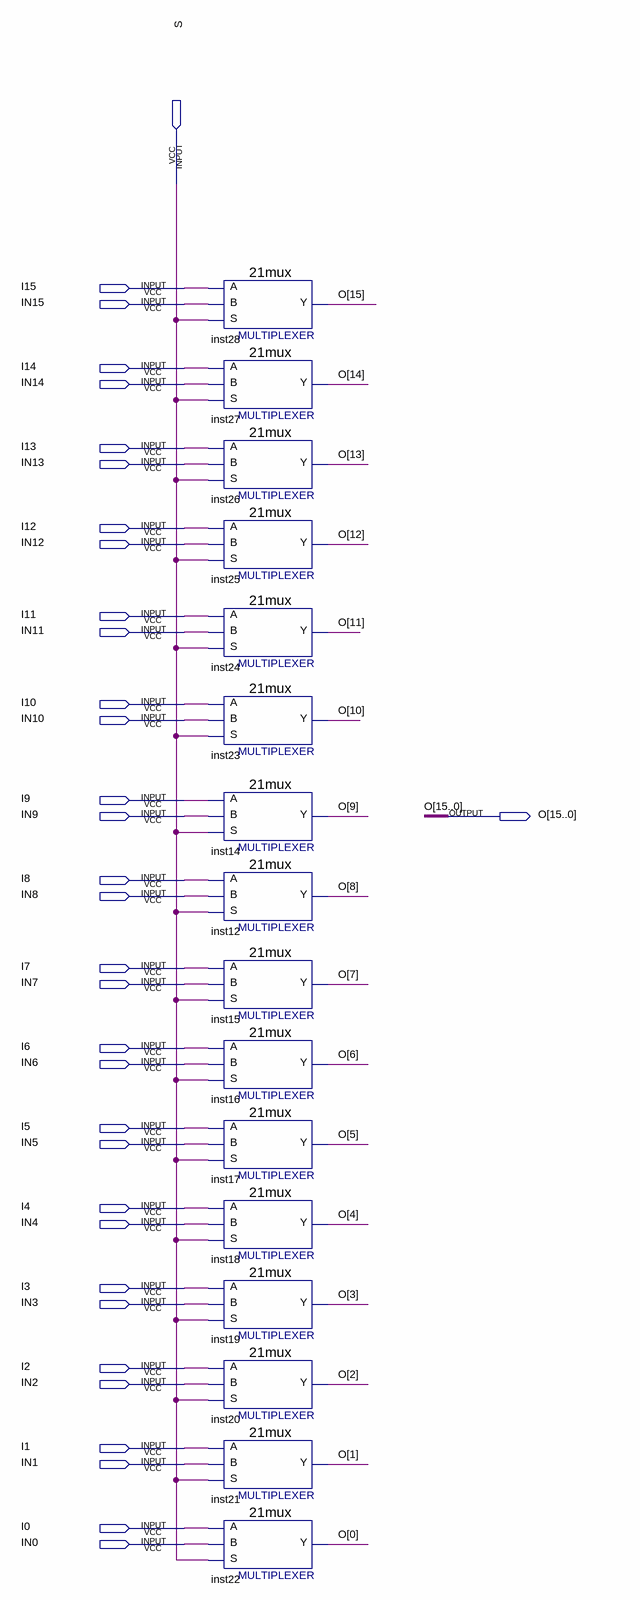
[diagram p0: schematic sheet]
// Quartus schematic mux16.bdf as structural Verilog: 16 symbols, 34 pins
module mux16 (
  input  S,
  input  I15,
  input  IN15,
  input  I14,
  input  IN14,
  input  I13,
  input  IN13,
  input  I12,
  input  IN12,
  input  I11,
  input  IN11,
  input  I10,
  input  IN10,
  input  I9,
  input  IN9,
  input  I8,
  input  IN8,
  input  I7,
  input  IN7,
  input  I6,
  input  IN6,
  input  I5,
  input  IN5,
  input  I4,
  input  IN4,
  input  I3,
  input  IN3,
  input  I2,
  input  IN2,
  input  I1,
  input  IN1,
  input  I0,
  input  IN0,
  output [15:0] O
);

  \21mux  inst28 (.S(S), .B(IN15), .A(I15), .Y(O[15]));
  \21mux  inst27 (.S(S), .B(IN14), .A(I14), .Y(O[14]));
  \21mux  inst26 (.S(S), .B(IN13), .A(I13), .Y(O[13]));
  \21mux  inst25 (.S(S), .B(IN12), .A(I12), .Y(O[12]));
  \21mux  inst24 (.S(S), .B(IN11), .A(I11), .Y(O[11]));
  \21mux  inst23 (.S(S), .B(IN10), .A(I10), .Y(O[10]));
  \21mux  inst14 (.S(S), .B(IN9), .A(I9), .Y(O[9]));
  \21mux  inst12 (.S(S), .B(IN8), .A(I8), .Y(O[8]));
  \21mux  inst15 (.S(S), .B(IN7), .A(I7), .Y(O[7]));
  \21mux  inst16 (.S(S), .B(IN6), .A(I6), .Y(O[6]));
  \21mux  inst17 (.S(S), .B(IN5), .A(I5), .Y(O[5]));
  \21mux  inst18 (.S(S), .B(IN4), .A(I4), .Y(O[4]));
  \21mux  inst19 (.S(S), .B(IN3), .A(I3), .Y(O[3]));
  \21mux  inst20 (.S(S), .B(IN2), .A(I2), .Y(O[2]));
  \21mux  inst21 (.S(S), .B(IN1), .A(I1), .Y(O[1]));
  \21mux  inst22 (.S(S), .B(IN0), .A(I0), .Y(O[0]));
endmodule
